# EasyEDA Pro project ACS DIN Controller.eprj, schematic Main Board
Board Name: V3.0.0 Main Board; Create Date: 2026-02-28; Page Name: Main Page; Project Name: ACS DIN Controller; Schematic Name: Main Board; Update Date: 2026-03-12
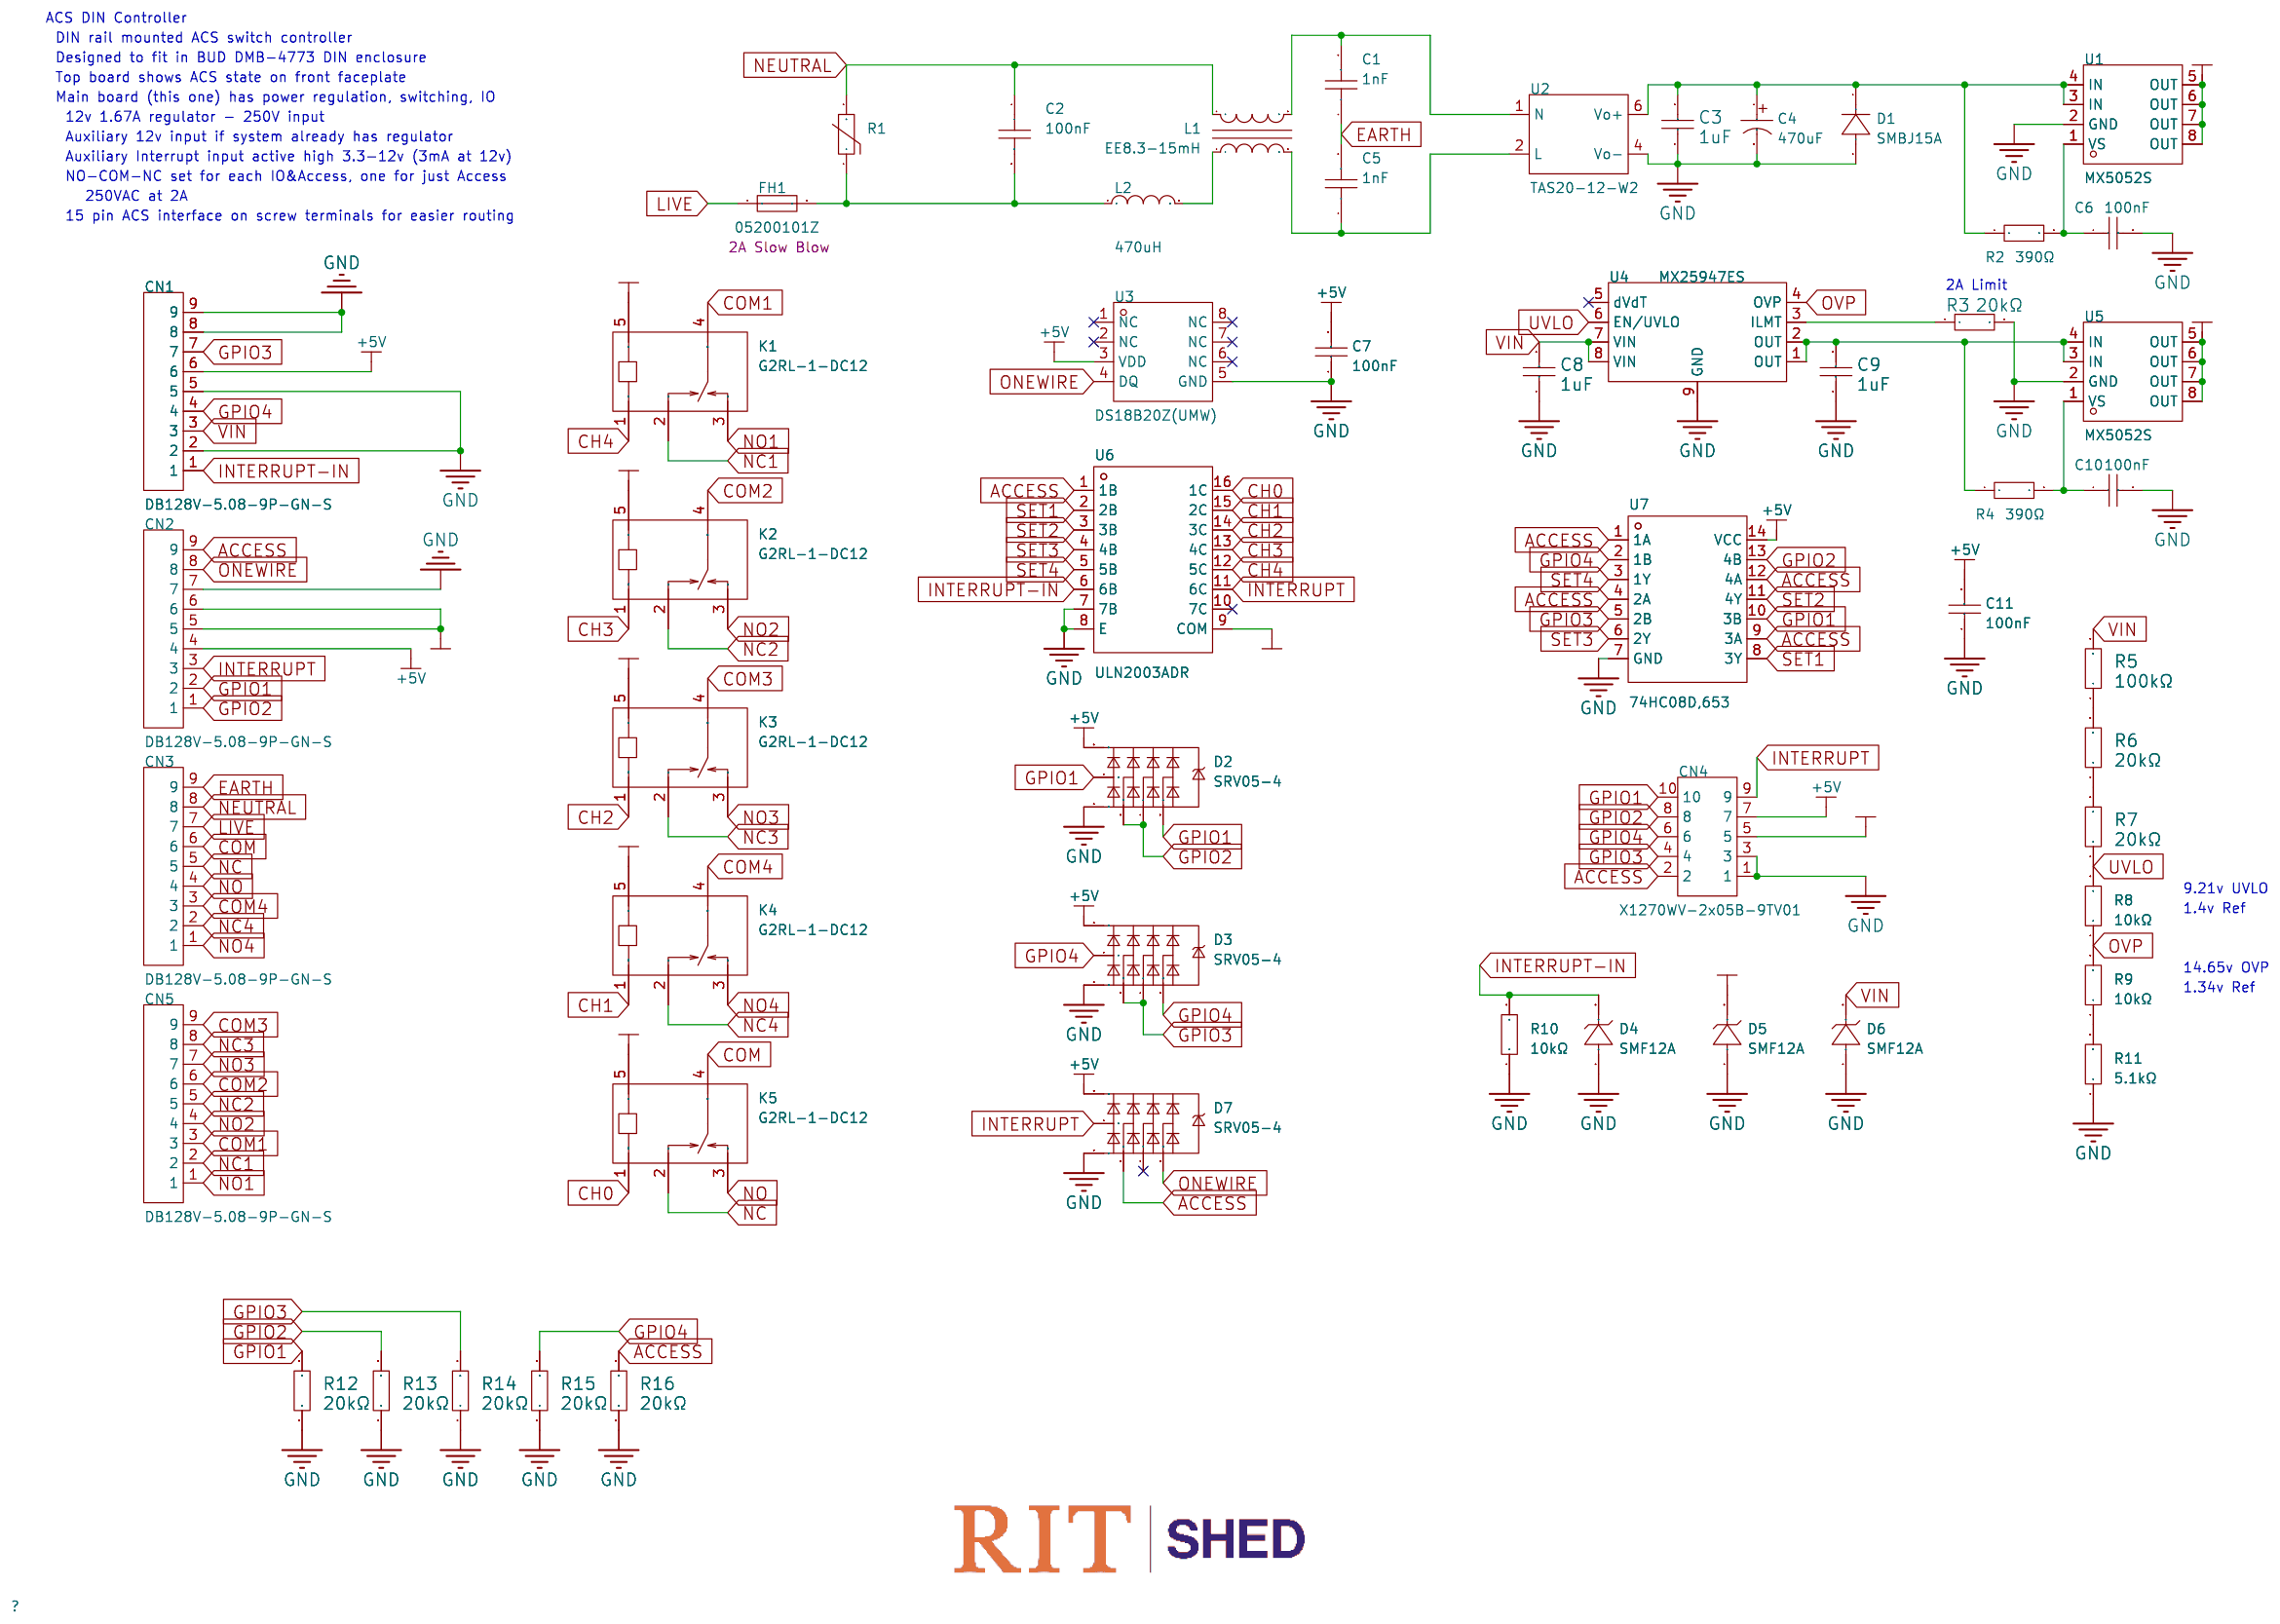
[diagram p0: schematic sheet]

## Parts
C1  1nF  [CAP-TH_L6.3-W4.4-P10.00-D0.6-S3.8]
C2  100nF  [CAP-TH_L13.0-W6.0-P10.00-D1.0]
C3  1uF  [C0805]
C4  470uF  [CAP-TH_BD10.0-P5.00-D1.0-FD]
C5  1nF  [CAP-TH_L6.3-W4.4-P10.00-D0.6-S3.8]
C6  100nF  [C0805]
C7  100nF  [C0805]
C8  1uF  [C0805]
C9  1uF  [C0805]
C10  100nF  [C0805]
C11  100nF  [C0805]
CN1  DB128V-5.08-9P-GN-S  [CONN-TH_9P-P5.08_DIBO_DB128V-5.08-9P-GN-S]
CN2  DB128V-5.08-9P-GN-S  [CONN-TH_9P-P5.08_DIBO_DB128V-5.08-9P-GN-S]
CN3  DB128V-5.08-9P-GN-S  [CONN-TH_9P-P5.08_DIBO_DB128V-5.08-9P-GN-S]
CN4  X1270WV-2x05B-9TV01  [IDC-TH_10P-P1.27-X1270WV-2X05A-6TV01]
CN5  DB128V-5.08-9P-GN-S  [CONN-TH_9P-P5.08_DIBO_DB128V-5.08-9P-GN-S]
D1  SMBJ15A  [SMB_L4.3-W3.6-LS5.3-RD]
D2  SRV05-4  [SOT-23-6_L2.9-W1.6-P0.95-LS2.8-BL-1]
D3  SRV05-4  [SOT-23-6_L2.9-W1.6-P0.95-LS2.8-BL-1]
D4  SMF12A  [SOD-123FL_L2.8-W1.8-LS3.8-R-RD]
D5  SMF12A  [SOD-123FL_L2.8-W1.8-LS3.8-R-RD]
D6  SMF12A  [SOD-123FL_L2.8-W1.8-LS3.8-R-RD]
D7  SRV05-4  [SOT-23-6_L2.9-W1.6-P0.95-LS2.8-BL-1]
FH1  05200101Z  [BAT-TH_05200101Z]
K1  G2RL-1-DC12  [RELAY-TH_G2RL-1-DCXX]
K2  G2RL-1-DC12  [RELAY-TH_G2RL-1-DCXX]
K3  G2RL-1-DC12  [RELAY-TH_G2RL-1-DCXX]
K4  G2RL-1-DC12  [RELAY-TH_G2RL-1-DCXX]
K5  G2RL-1-DC12  [RELAY-TH_G2RL-1-DCXX]
L1  EE8.3-15mH  [XFMR-TH_4P-L9.5-W9.5_EE8.3-10MH]
L2  470uH  [IND-TH_BD8.7-P5.0-D0.7_RLB0914]
R1  210pF@1kHz  [RES-TH_L12.5-W5.1-P7.50-D1.2-S2.20]
R2  390Ω  [R0805]
R3  20kΩ  [R0805]
R4  390Ω  [R0805]
R5  100kΩ  [R0805]
R6  20kΩ  [R0805]
R7  20kΩ  [R0805]
R8  10kΩ  [R0805]
R9  10kΩ  [R0805]
R10  10kΩ  [R0805]
R11  5.1kΩ  [R0805]
R12  20kΩ  [R0805]
R13  20kΩ  [R0805]
R14  20kΩ  [R0805]
R15  20kΩ  [R0805]
R16  20kΩ  [R0805]
U1  MX5052S  [SOP-8_L4.9-W3.9-P1.27-LS6.0-BL]
U2  TAS20-12-W2  [PWRM-TH_4P-L39.0-W25.0_TAS12-15-W2]
U3  DS18B20Z(UMW)  [SOP-8_L4.9-W3.9-P1.27-LS6.0-BL]
U4  MX25947ES  [ESOP-8_L4.9-W3.9-P1.27-LS6.0-BL-EP-1]
U5  MX5052S  [SOP-8_L4.9-W3.9-P1.27-LS6.0-BL]
U6  ULN2003ADR  [SOIC-16_L9.9-W3.9-P1.27-LS6.0-BL]
U7  74HC08D,653  [SOIC-14_L8.7-W3.9-P1.27-LS6.0-BL]

## Library data of the parts
C1 C5 = CY1102ME14EF45W2A2: LCSC Part Name: 1nF ±20% 400V 等级:Y1; Supplier Part: C2974845; Manufacturer: Dersonic(德尔创); Supplier Footprint: 插件,P=10mm; JLCPCB Part Class: Extended Part; Datasheet: https://item.szlcsc.com/datasheet/CY1102ME14EF45W2A2/3377867.html; Supplier: LCSC; Tolerance: ±20%; Voltage(AC): 400V; Ratings: Y1; safety certification: CQC；CUL；UL；ENEC；VDE; Operating Temperature: -40℃~+125℃
C2 = MP2104K27C3X6LC: LCSC Part Name: 100nF ±10% 275V 等级:X2; Supplier Part: C105759; Manufacturer: SRD(圣融达); Supplier Footprint: 插件,P=10mm; JLCPCB Part Class: Extended Part; Datasheet: https://item.szlcsc.com/datasheet/MP2104K27C3X6LC/106974.html; Supplier: LCSC; Tolerance: ±10%; Voltage(AC): 275V; Ratings: X2; safety certification: UL；ENEC；VDE；CQC；CSA
C3 C8 C9 = CL21B105KBFNNNE: LCSC Part Name: 1uF ±10% 50V; Supplier Part: C28323; Manufacturer: SAMSUNG(三星); Supplier Footprint: 0805; Datasheet: https://item.szlcsc.com/datasheet/CL21B105KBFNNNE/29074.html; Supplier: LCSC; Tolerance: ±10%; Voltage Rating: 50V; Temperature Coefficient: X7R
C4 = ERS1VM471G16OT: LCSC Part Name: 470uF ±20% 35V; Supplier Part: C106703; Manufacturer: AISHI(艾华集团); Supplier Footprint: 插件,D10xL16mm; JLCPCB Part Class: Extended Part; Datasheet: https://item.szlcsc.com/datasheet/ERS1VM471G16OT/107919.html; Supplier: LCSC; Tolerance: ±20%; Voltage Rating: 35V; Pin Spacing: 5mm; Diameter: 10mm; Height - Seated (Max): 16mm; Lifetime: 7000hrs@105℃
C6 C7 C10 C11 = CL21B104KCFNNNE: LCSC Part Name: 100nF ±10% 100V; Supplier Part: C28233; Manufacturer: SAMSUNG(三星); Supplier Footprint: 0805; JLCPCB Part Class: Basic Part; Datasheet: https://item.szlcsc.com/datasheet/CL21B104KCFNNNE/28983.html; Supplier: LCSC; Tolerance: ±10%; Voltage Rating: 100V; Temperature Coefficient: X7R
CN1-CN3 CN5 = DB128V-5.08-9P-GN-S: LCSC Part Name: 1x9P 5.08mm 直插 排数:1 每排P数:9; Supplier Part: C2938972; Manufacturer: DORABO(地博电气); Supplier Footprint: 插件,P=5.08mm; JLCPCB Part Class: Extended Part; Datasheet: https://item.szlcsc.com/datasheet/DB128V-5.08-9P-GN-S/3298858.html; Supplier: LCSC; Number of Positions or Pins: 1x9P; Pitch: 5.08mm; Color: Green; Mounting Type: Through Hole; Number of Pins: 9P; Number of Rows: 1; Number of PINs Per Row: 9; Screw Specification: M2.5; Current Rating: 16A; Voltage Rating (Max): 300V; Wire Gauge - AWG: 12~22; Wire Gauge - mm2: 2.5; Operating Temperature: -40℃~+105℃
CN4 = X1270WV-2x05B-9TV01: LCSC Part Name: 1.27mm 2x5P 排数:2 每排P数:5; Supplier Part: C2962225; Manufacturer: XKB Connection(中国星坤); Supplier Footprint: 插件,P=1.27mm; Datasheet: https://item.szlcsc.com/datasheet/X1270WV-2x05B-9TV01/3351701.html; Supplier: LCSC; Connector Type: IDC Header; Pitch: 1.27mm; Number of Positions or Pins: 2x5P; Current Rating: 1A; Voltage Rating (Max): 250V; Holder Type: Through Hole; Row Spacing: 1.27mm; Number of Rows: 2; Number of PINs Per Row: 5; Contact Plating: Gold; Operating Temperature: -40℃~+125℃; Color: Black
D1 = SMBJ15A_C19077569: LCSC Part Name: 单向TVS 15V截止 峰值浪涌电流：24.59A@10/1000us; Supplier Part: C19077569; Manufacturer: R+O(宏嘉诚); Supplier Footprint: DO-214AA(SMB); JLCPCB Part Class: Extended Part; Datasheet: https://item.szlcsc.com/datasheet/SMBJ15A/20275654.html; Supplier: LCSC; Polarity: Unidirectional; Reverse Stand-Off Voltage (Vrwm): 15V; Clamping Voltage: 24.4V; Peak Pulse Current (Ipp): 24.59A@10/1000us; Peak Pulse Power Dissipation (Ppp): 600W@10/1000us; Voltage - Breakdown: 18.5V; Reverse Leakage Current (Ir): 5uA; Operating Temperature: -55℃~+150℃; level of protection: IEC 61000-4-2; Type: TVS
D2 D3 D7 = SRV05-4_C7420376: LCSC Part Name: 丝印 V05 双向ESD 5V截止 峰值浪涌电流：5A; Supplier Part: C7420376; Manufacturer: R+O(宏嘉诚); Supplier Footprint: SOT-23-6L; Datasheet: https://item.szlcsc.com/datasheet/SRV05-4/8397198.html; Supplier: LCSC; Polarity: Unidirectional; Reverse Stand-Off Voltage (Vrwm): 5V; Clamping Voltage: 15V; Peak Pulse Current (Ipp): 4A; Peak Pulse Power Dissipation (Ppp): 80W; Voltage - Breakdown: 6V; Reverse Leakage Current (Ir): 5uA; Number of Channels: 4; Operating Temperature: -55℃~+150℃; level of protection: IEC 61000-4-2；IEC 61000-4-5; Type: ESD; Junction Capacitance: 1pF
D4-D6 = SMF12A_C19077506: LCSC Part Name: 单向TVS 12V截止 峰值浪涌电流：10.1A@10/1000us; Supplier Part: C19077506; Manufacturer: R+O(宏嘉诚); Supplier Footprint: SOD-123FL; JLCPCB Part Class: Extended Part; Datasheet: https://item.szlcsc.com/datasheet/SMF12A/20275591.html; Supplier: LCSC; Polarity: Unidirectional; Reverse Stand-Off Voltage (Vrwm): 12V; Clamping Voltage: 19.9V; Peak Pulse Current (Ipp): 10.1A@10/1000us; Peak Pulse Power Dissipation (Ppp): 200W@10/1000us; Voltage - Breakdown: 14.7V; Reverse Leakage Current (Ir): 2.5uA; Operating Temperature: -55℃~+150℃; level of protection: IEC 61000-4-2; Type: TVS
FH1 = 05200101Z: LCSC Part Name: 600V 10A 保险丝座; Supplier Part: C142924; Manufacturer: Littelfuse(美国力特); Datasheet: https://item.szlcsc.com/datasheet/05200101Z/154255.html; Supplier: LCSC; Fuseholder Type: Clip; Voltage Rating: 600V; Current Rating: 10A; Fuse Type: Cylindrical; Fuse Diameter (φD): 5mm; Fuse Length: 20mm; Note: 2A Slow Blow
K1-K5 = G2RL-1-DC12: LCSC Part Name: 12V 12A 一组转换:1C(单刀双掷-转换); Supplier Part: C469130; Manufacturer: OMRON(欧姆龙); Supplier Footprint: 插件,28.8x12.5mm; JLCPCB Part Class: Extended Part; Datasheet: https://item.szlcsc.com/datasheet/G2RL-1-DC12/475009.html; Supplier: LCSC; Coil Voltage: 12V; Contact Form: 1 Form C: 1C (SPDT-CO); Number of Pins: 5; Contact Rating: 12A@25VDC；12A@250VAC; Switching Voltage(Max): 440V@AC；300V@DC; Coil Rated Power: 400mW; Contact Material: Silver Alloy (Cd-Free); Switching Current(Max): 12A; Coil Type: Non-Polarized - Single Coil; Coil Resistance: 360Ω; Contact Resistance: 100mΩ; Operate Time: 15ms; Release Time: 5ms; Operating Temperature: -40℃~+85℃
L1 = EE8.3-15mH: LCSC Part Name: 共模滤波器; Supplier Part: C18870246; Manufacturer: NYBOXING(尼博星); Supplier Footprint: 插件; Datasheet: https://item.szlcsc.com/datasheet/EE8.3-15mH/20064822.html; Supplier: LCSC; Inductance @ Frequency: 15mH@10kHz; Current Rating: 180mA; Voltage Withstand: 1.5kV; DC Resistance(DCR): 5Ω; Operating Temperature: -40℃~+125℃; Insulation Resistance(IR): 100MΩ
L2 = RLB0914-471KL: LCSC Part Name: 470uH ±10% 1A; Supplier Part: C7051049; Manufacturer: BOURNS; Supplier Footprint: 插件,D=8.7mm; Datasheet: https://item.szlcsc.com/datasheet/RLB0914-471KL/8017672.html; Supplier: LCSC; Tolerance: ±10%; Current Rating: 560mA; Current - Saturation(Isat): 1A; DC Resistance(DCR): 1.3Ω
R1 = VDR-10D471K: LCSC Part Name: 钳位电压775V 67焦耳 插件压敏电阻; Supplier Part: C316609; Manufacturer: VDR(嵩隆); Supplier Footprint: 插件,P=7.5mm; JLCPCB Part Class: Extended Part; Datasheet: https://item.szlcsc.com/datasheet/VDR-10D471K/298277.html; Supplier: LCSC; Varistor Voltage: 423V~517V; Clamping Voltage: 775V; Maximum DC Volts: 385V; Maximum AC Volts: 300V; Peak Current: 2.5kA; Energy: 67J; Rated Wattage: 400mW
R2 R4 = 0805W8F3900T5E: LCSC Part Name: 390Ω ±1% 125mW 厚膜电阻; Supplier Part: C17655; Manufacturer: UNI-ROYAL(厚声); Supplier Footprint: 0805; Datasheet: https://item.szlcsc.com/datasheet/0805W8F3900T5E/18343.html; Supplier: LCSC; Type: Thick Film Resistor; Tolerance: ±1%; Power(Watts): 125mW; Voltage-Supply(Max): 150V; Temperature Coefficient: ±100ppm/℃; Operating Temperature: -55℃~+155℃
R3 R6 R7 R12-R16 = 0805W8F2002T5E: LCSC Part Name: 20kΩ ±1% 125mW 厚膜电阻; Supplier Part: C4328; Manufacturer: UNI-ROYAL(厚声); Supplier Footprint: 0805; JLCPCB Part Class: Basic Part; Datasheet: https://atta.szlcsc.com/upload/public/pdf/source/20200306/C422600_1E6D84923E4A46A82E41ADD87F860B5C.pdf; Supplier: LCSC; Type: Thick Film Resistors; Tolerance: ±1%; Temperature Coefficient: ±100ppm/℃; Operating Temperature Range: -55℃~+155℃
R5 = 0805W8F1003T5E: LCSC Part Name: 100kΩ ±1% 125mW 厚膜电阻; Supplier Part: C149504; Manufacturer: UNI-ROYAL(厚声); Supplier Footprint: 0805; Datasheet: https://item.szlcsc.com/datasheet/0805W8F1003T5E/160838.html; Supplier: LCSC; Type: Thick Film Resistor; Tolerance: ±1%; Power(Watts): 125mW; Voltage-Supply(Max): 150V; Temperature Coefficient: ±100ppm/℃; Operating Temperature: -55℃~+155℃
R8-R10 = 0805W8F1002T5E: LCSC Part Name: 10kΩ ±1% 125mW 厚膜电阻; Supplier Part: C17414; Manufacturer: UNI-ROYAL(厚声); Supplier Footprint: 0805; Datasheet: https://item.szlcsc.com/datasheet/0805W8F1002T5E/18102.html; Supplier: LCSC; Type: Thick Film Resistor; Tolerance: ±1%; Power(Watts): 125mW; Voltage-Supply(Max): 150V; Temperature Coefficient: ±100ppm/℃; Operating Temperature: -55℃~+155℃
R11 = 0805W8F5101T5E: LCSC Part Name: 5.1kΩ ±1% 125mW 厚膜电阻; Supplier Part: C27834; Manufacturer: UNI-ROYAL(厚声); Supplier Footprint: 0805; JLCPCB Part Class: Basic Part; Datasheet: https://item.szlcsc.com/datasheet/0805W8F5101T5E/28584.html; Supplier: LCSC; Type: Thick Film Resistor; Tolerance: ±1%; Power(Watts): 125mW; Voltage-Supply(Max): 150V; Temperature Coefficient: ±100ppm/℃; Operating Temperature: -55℃~+155℃
U1 U5 = MX5052S: LCSC Part Name: 集成MOS Oring控制器; Supplier Part: C5875696; Manufacturer: Wuxi Maxinmicro(无锡明芯微); Supplier Footprint: SOP-8; JLCPCB Part Class: Extended Part; Datasheet: https://item.szlcsc.com/datasheet/MX5052S/6809525.html; Supplier: LCSC
U2 = TAS20-12-W2: LCSC Part Name: 小体积AC-DC电源模块; Supplier Part: C39846906; Manufacturer: TDPOWER(腾达电源); Supplier Footprint: 插件,39x25mm; Datasheet: https://item.szlcsc.com/datasheet/TAS20-12-W2/41578643.html; Supplier: LCSC; Conversion Type: AC/DC-DC; Number of Outputs: 1; Voltage - Input(DC): 100V~370V; Voltage - Input(AC): 85VAC~265VAC; Output Voltage: 12V; Output Voltage Accuracy: ±2%; Output Current(Max): 1.67A; Output Power: 20W; Quiescent Dissipation: 0.15W; Conversion Efficiency: 88%; Ripple Noise: 100mVp-p; Capacitive Load(Max): 3300uF; Features: Over Current Protection；Short Circuit Protection; Isolation Voltage(Vrms): 2.5kV; Length: 39mm; Width: 25mm; Height: 21mm; Switching Frequency: 100kHz
U3 = DS18B20Z(UMW): LCSC Part Name: 温度传感器; Supplier Part: C695837; Manufacturer: UMW(友台半导体); Supplier Footprint: SOIC-8; JLCPCB Part Class: Extended Part; Datasheet: https://atta.szlcsc.com/upload/public/pdf/source/20241210/329D6A12FB6ADF2EBB286F6D44242ED4.pdf; Supplier: LCSC; Resolution: ±0.4℃; Supply Voltage: 2.5V~5.5V
U4 = MX25947ES: LCSC Part Name: E-Fuse,过流过压保护电子保险丝; Supplier Part: C5875698; Manufacturer: Wuxi Maxinmicro(无锡明芯微); Supplier Footprint: ESOP8; JLCPCB Part Class: Extended Part; Datasheet: https://item.szlcsc.com/datasheet/MX25947ES/6809527.html; Supplier: LCSC
U6 = ULN2003ADR: LCSC Part Name: 高压、大电流达林顿晶体管阵列; Supplier Part: C7512; Manufacturer: TI(德州仪器); Supplier Footprint: SOIC-16; JLCPCB Part Class: Basic Part; Datasheet: https://www.ti.com/cn/lit/gpn/uln2003a; Supplier: LCSC; number of channels: 7; Collector - Emitter Voltage VCEO: 50V; Current - Collector(Ic): 500mA; Voltage - Input(Max): 30V; Output Leakage Current(Icex): 50uA; Voltage - Forward(Vf): 1.7V; Reverse Leakage Current (Ir): 50uA; Input Capacitiance(Ci): 15pF
U7 = 74HC08D,653: LCSC Part Name: 四路二输入与门; Supplier Part: C5593; Manufacturer: Nexperia(安世); Supplier Footprint: SOIC-14; JLCPCB Part Class: Extended Part; Datasheet: https://item.szlcsc.com/datasheet/74HC08D%252C653/6044.html; Supplier: LCSC; Logic Type: AND Gate; Number of Channels: 4; Voltage - Supply: 2V~6V; Quiescent Current: 2uA; Current - Output Low(IOL): 5.2mA; Current - Output High(IOH): 5.2mA; Input Logic Level - High: 1.5V~4.2V; Input Logic Level - Low: 500mV~1.8V; Output Logic Level - High: 3.7V；1.9V；5.2V; Output Logic Level - Low: 100mV；400mV; Series: 74HC Series; Propagation Delay: 27ns@4.5V,50pF; Operating Temperature: -40℃~+125℃; Input Number: 2

## Nets
+5V: C7.2 C11.2 CN1.6 CN2.4 CN4.7 D2.5 D3.5 D7.5 U3.3(VDD) U7.14(VCC)
+12V: CN2.5 CN2.6 CN4.5 D5.2(K) K1.5(NO) K2.5(NO) K3.5(NO) K4.5(NO) K5.5(NO) U1.5(OUT) U1.6(OUT) U1.7(OUT) U1.8(OUT) U5.5(OUT) U5.6(OUT) U5.7(OUT) U5.8(OUT) U6.9(COM)
GND: C3.1 C4.2 C6.2 C7.1 C8.1 C9.1 C10.2 C11.1 CN1.2 CN1.5 CN1.8 CN1.9 CN2.7 CN4.1 CN4.3 D1.2(A) D2.2 D3.2 D4.1(A) D5.1(A) D6.1(A) D7.2 R3.2 R10.1 R11.1 R12.1 R13.1 R14.1 R15.1 R16.1 U1.2(GND) U2.4(Vo-) U3.5(GND) U4.9(GND) U5.2(GND) U6.7(7B) U6.8(E) U7.7(GND)
VIN: C8.2 CN1.3 D6.2(K) R5.2 U4.7(VIN) U4.8(VIN)
ACCESS: CN2.9 CN4.2 D7.3 R16.2 U6.1(1B) U7.1(1A) U7.4(2A) U7.9(3A) U7.12(4A)
CH0: K5.1(COL1) U6.16(1C)
CH1: K4.1(COL1) U6.15(2C)
CH2: K3.1(COL1) U6.14(3C)
CH3: K2.1(COL1) U6.13(4C)
CH4: K1.1(COL1) U6.12(5C)
COM: CN3.6 K5.4(NO)
COM1: CN5.3 K1.4(NO)
COM2: CN5.6 K2.4(NO)
COM3: CN5.9 K3.4(NO)
COM4: CN3.3 K4.4(NO)
EARTH: C1.1 C5.2 CN3.9
GPIO1: CN2.2 CN4.10 D2.1 D2.6 R12.2 U7.10(3B)
GPIO2: CN2.1 CN4.8 D2.3 D2.4 R13.2 U7.13(4B)
GPIO3: CN1.7 CN4.4 D3.3 D3.4 R14.2 U7.5(2B)
GPIO4: CN1.4 CN4.6 D3.1 D3.6 R15.2 U7.2(1B)
INTERRUPT: CN2.3 CN4.9 D7.1 U6.11(6C)
INTERRUPT-IN: CN1.1 D4.2(K) R10.2 U6.6(6B)
LIVE: CN3.7 FH1.1
NC: CN3.5 K5.2(NC)
NC1: CN5.2 K1.2(NC)
NC2: CN5.5 K2.2(NC)
NC3: CN5.8 K3.2(NC)
NC4: CN3.2 K4.2(NC)
NEUTRAL: C2.1 CN3.8 L1.1 R1.2
NO: CN3.4 K5.3(COM)
NO1: CN5.1 K1.3(COM)
NO2: CN5.4 K2.3(COM)
NO3: CN5.7 K3.3(COM)
NO4: CN3.1 K4.3(COM)
ONEWIRE: CN2.8 D7.6 U3.4(DQ)
OVP: R8.1 R9.2 U4.4(OVP)
SET1: U6.2(2B) U7.8(3Y)
SET2: U6.3(3B) U7.11(4Y)
SET3: U6.4(4B) U7.6(2Y)
SET4: U6.5(5B) U7.3(1Y)
UVLO: R7.1 R8.2 U4.6(EN/UVLO)
$1N1296: C2.2 FH1.2 L2.1 R1.1
$1N1509: L1.4 L2.2
$1N1600: C5.1 L1.3 U2.2(L)
$1N1606: C1.2 L1.2 U2.1(N)
$1N2305: C3.2 C4.1 D1.1(K) R2.1 U1.3(IN) U1.4(IN) U2.6(Vo+)
$1N2711: C6.1 R2.2 U1.1(VS)
$1N3088: C9.2 R4.1 U4.1(OUT) U4.2(OUT) U5.3(IN) U5.4(IN)
$1N3094: C10.1 R4.2 U5.1(VS)
$1N3559: R3.1 U4.3(ILMT)
$1N3866: R5.1 R6.2
$1N3905: R6.1 R7.2
$1N4022: R9.1 R11.2

Not connected (* = marked no-connect by the designer): D7 4*; U3 1(NC)* 2(NC)* 6(NC)* 7(NC)* 8(NC)*; U4 5(dVdT)*; U6 10(7C)*

## Notes on the sheet
- ACS DIN Controller
- DIN rail mounted ACS switch controller
- Designed to fit in BUD DMB-4773 DIN enclosure
- Top board shows ACS state on front faceplate
- Main board (this one) has power regulation, switching, IO
- 12v 1.67A regulator - 250V input
- Auxiliary 12v input if system already has regulator
- Auxiliary Interrupt input active high 3.3-12v (3mA at 12v)
- NO-COM-NC set for each IO&Access, one for just Access
- 250VAC at 2A
- 15 pin ACS interface on screw terminals for easier routing
- 2A Limit
- 9.21v UVLO
- 1.4v Ref
- 14.65v OVP
- 1.34v Ref
